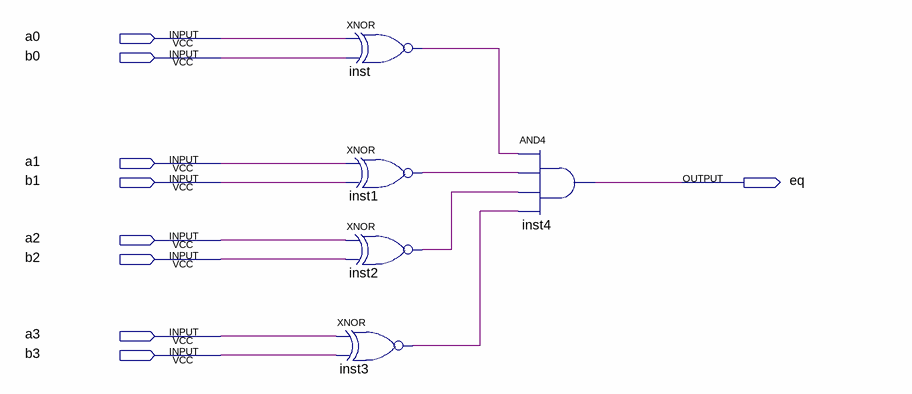
[diagram p0: schematic sheet]
// Quartus schematic eq.bdf as structural Verilog: 5 symbols, 9 pins
module eq (
  input  a0,
  input  b0,
  input  a1,
  input  b1,
  input  a2,
  input  b2,
  input  a3,
  input  b3,
  output eq
);

  wire inst1_out, inst2_out, inst3_out, inst_out;

  xnor inst (inst_out, a0, b0);
  xnor inst1 (inst1_out, a1, b1);
  xnor inst2 (inst2_out, a2, b2);
  xnor inst3 (inst3_out, a3, b3);
  and inst4 (eq, inst_out, inst1_out, inst2_out, inst3_out);
endmodule
